# EAGLE design avrcam (EAGLE 4.13)

## Sheet 1 of 2
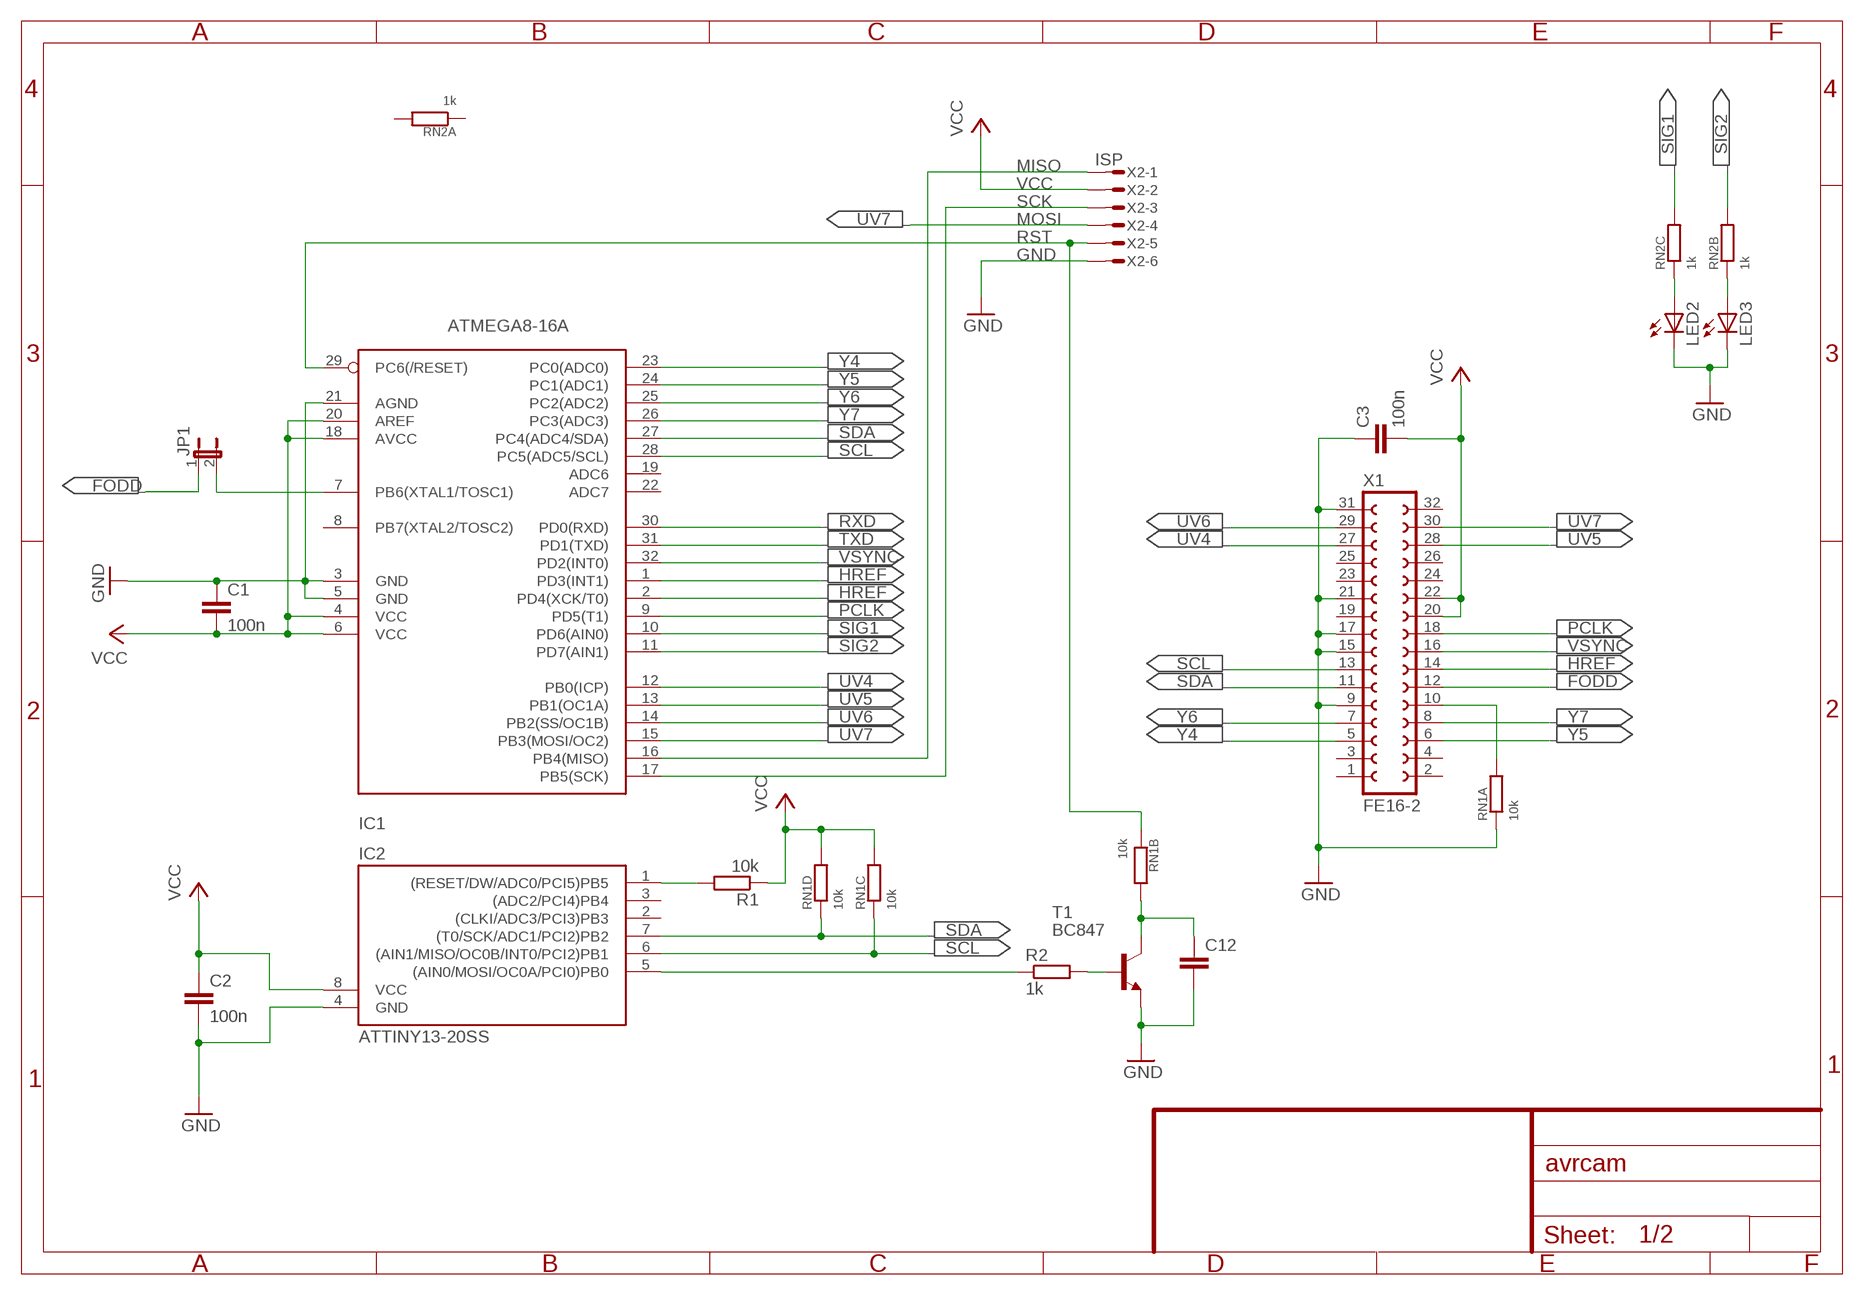
[diagram p0: schematic, sheet 1]

### Parts
C1  100n  C-EUC0603K  [C0603K]
C2  100n  C-EUC0603K  [C0603K]
C3  100n  C-EUC0603K  [C0603K]
C12  C-EUC0603K  [C0603K]
IC1  ATMEGA8-16A  [TQFP32-08]
IC2  ATTINY13-20SS  [SO08]
JP1  JP1E  [JP1]
LED2  LEDCHIPLED_1206  [CHIPLED_1206]
LED3  LEDCHIPLED_1206  [CHIPLED_1206]
R1  10k  R-EU_R0805  [R0805]
R2  1k  R-EU_R0805  [R0805]
RN1  10k  SMDNET4SINGLE  [SMDNET4]
RN2  1k  SMDNET4SINGLE  [SMDNET4]
T1  BC847  [SOT23]
X1  FE16-2  [FE16-2]
X2  ISP  MICROMATCH-6  [MICROMATCH-6]

### Nets
FODD: JP1.1 X1.12
GND: C1.1 C2.2 C3.1 C12.2 IC1.3(GND) IC1.5(GND) IC1.21(AGND) IC2.4(GND) LED2.C LED3.C RN1.1 T1.2(E) X1.9 X1.15 X1.17 X1.21 X1.31 X2.6 ; also sheet 2
HREF: IC1.1(PD3(INT1)) IC1.2(PD4(XCK/T0)) X1.14
MISO: IC1.16(PB4(MISO)) X2.1
N$1: IC2.1((RESET/DW/ADC0/PCI5)PB5) R1.2
N$2: IC1.7(PB6(XTAL1/TOSC1)) JP1.2
N$6: IC2.5((AIN0/MOSI/OC0A/PCI0)PB0) R2.1
N$9: R2.2 T1.1(B)
N$14: C12.1 RN1.7 T1.3(C)
N$15: LED3.A RN2.2
N$16: LED2.A RN2.3
N$18: RN1.8 X1.10
PCLK: IC1.9(PD5(T1)) X1.18
RST: IC1.29(PC6(/RESET)) RN1.2 X2.5
RXD: IC1.30(PD0(RXD)) ; also sheet 2
SCK: IC1.17(PB5(SCK)) X2.3
SCL: IC1.28(PC5(ADC5/SCL)) IC2.6((AIN1/MISO/OC0B/INT0/PCI2)PB1) RN1.3 X1.13
SDA: IC1.27(PC4(ADC4/SDA)) IC2.7((T0/SCK/ADC1/PCI2)PB2) RN1.4 X1.11
SIG1: IC1.10(PD6(AIN0)) RN2.6
SIG2: IC1.11(PD7(AIN1)) RN2.7
TXD: IC1.31(PD1(TXD)) ; also sheet 2
UV4: IC1.12(PB0(ICP)) X1.27
UV5: IC1.13(PB1(OC1A)) X1.28
UV6: IC1.14(PB2(SS/OC1B)) X1.29
UV7: IC1.15(PB3(MOSI/OC2)) X1.30 X2.4
VCC: C1.2 C2.1 C3.2 IC1.4(VCC) IC1.6(VCC) IC1.18(AVCC) IC1.20(AREF) IC2.8(VCC) R1.1 RN1.5 RN1.6 X1.20 X1.22 X2.2 ; also sheet 2
VSYNC: IC1.32(PD2(INT0)) X1.16
Y4: IC1.23(PC0(ADC0)) X1.5
Y5: IC1.24(PC1(ADC1)) X1.6
Y6: IC1.25(PC2(ADC2)) X1.7
Y7: IC1.26(PC3(ADC3)) X1.8
Unconnected: IC1.8(PB7(XTAL2/TOSC2)) IC1.19(ADC6) IC1.22(ADC7) IC2.2((CLKI/ADC3/PCI3)PB3) IC2.3((ADC2/PCI4)PB4) X1.1 X1.2 X1.3 X1.4 X1.19 X1.23 X1.24 X1.25 X1.26 X1.32

### Notes on the sheet
- MOSI

## Sheet 2 of 2
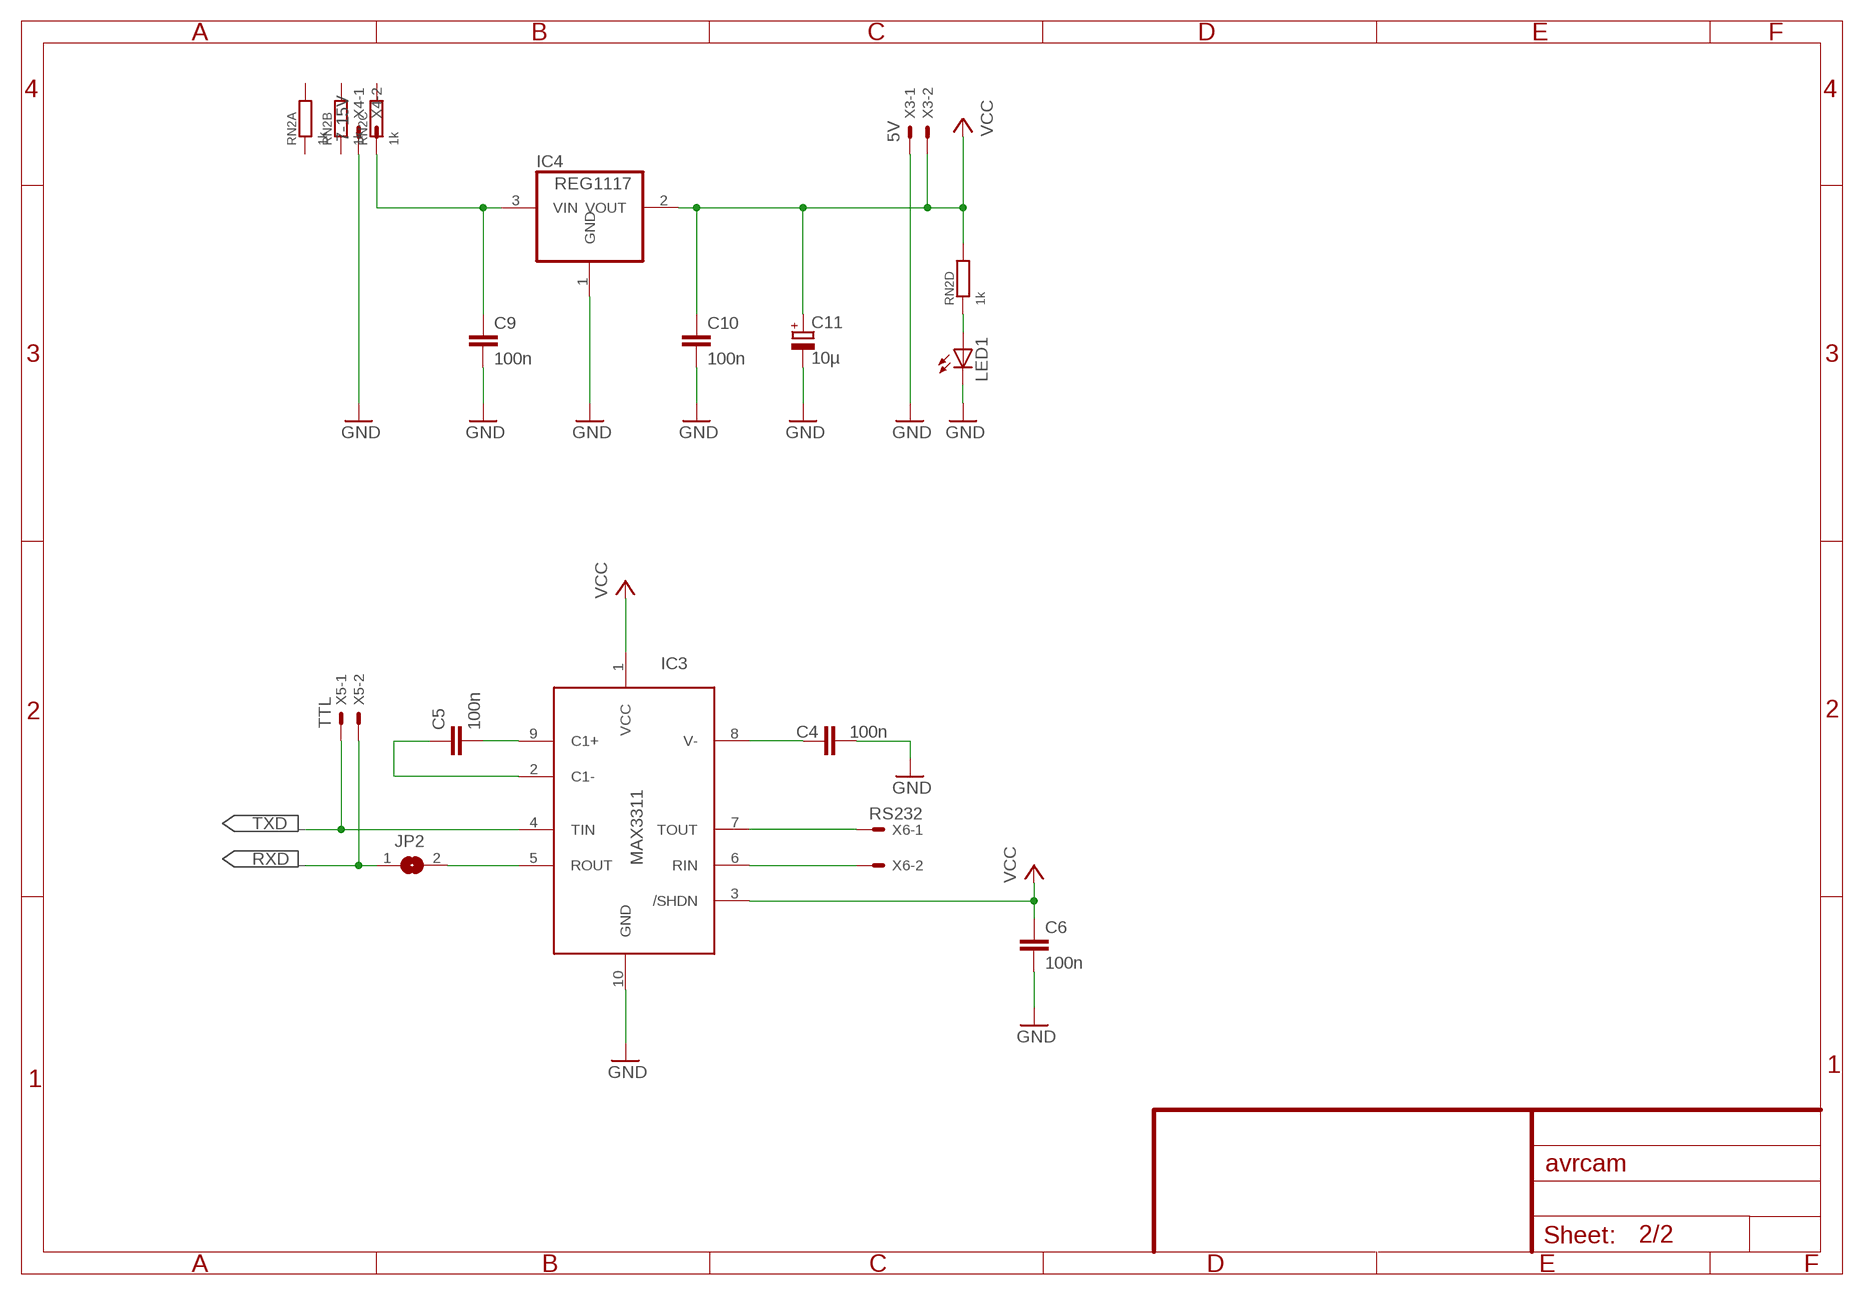
[diagram p1: schematic, sheet 2]

### Parts
C4  100n  C-EUC0603K  [C0603K]
C5  100n  C-EUC0603K  [C0603K]
C6  100n  C-EUC0603K  [C0603K]
C9  100n  C-EUC0603K  [C0603K]
C10  100n  C-EUC0603K  [C0603K]
C11  10µ  CPOL-EUCT3216  [CT3216]
IC3  MAX3311  [UMAX10]
IC4  REG1117  [SOT223]
JP2  SJ  [SJ]
LED1  LEDCHIPLED_1206  [CHIPLED_1206]
X3  5V  22-23-2021  [22-23-2021]
X4  7-15V  22-23-2021  [22-23-2021]
X5  TTL  22-23-2021  [22-23-2021]
X6  RS232  22-23-2021  [22-23-2021]

### Nets
GND: C4.2 C6.2 C9.2 C10.2 C11.- IC3.10(GND) IC4.1(GND) LED1.C X3.1 X4.1 ; also sheet 1
N$3: C5.2 IC3.9(C1+)
N$4: C5.1 IC3.2(C1-)
N$5: C4.1 IC3.8(V-)
N$7: IC3.5(ROUT) JP2.2
N$8: C9.1 IC4.3(VIN) X4.2
N$10: IC3.6(RIN) X6.2
N$11: IC3.7(TOUT) X6.1
N$12: LED1.A RN2.4
RXD: JP2.1 X5.2 ; also sheet 1
TXD: IC3.4(TIN) X5.1 ; also sheet 1
VCC: C6.1 C10.1 C11.+ IC3.1(VCC) IC3.3(/SHDN) IC4.2(VOUT) RN2.5 X3.2 ; also sheet 1
Unconnected: RN2.1 RN2.8

## Library data of the parts
C1-C6 C9 C10 C12 = rcl:C-EU: CAPACITOR, European symbol
C11 = rcl:CPOL-EU: POLARIZED CAPACITOR, European symbol
IC1 = avr:ATMEGA8: MICROCONTROLLER 8 Kbytes FLASH 1 kbytes SRAM 512 bytes EEPROM USART 6-channel 10 bit ADC 2-channel 8 bit ADC
IC2 = avr:ATTINY13: MICROCONTROLLER 1 Kbytes FLASH 64 bytes EEPROM 64 bytes RAM 4-channel 10 bit ADC
IC3 = maxim_updated:MAX3311
IC4 = burr-brown:REG1117: 800mA and 1A Low Dropout (LDO) Positive Regulator 1.8V, 2.5V, 2.85V, 3.3V, 5V, and Adj
JP1 = jumper:JP1E: JUMPER
JP2 = jumper:SJ: SMD solder JUMPER
LED1-LED3 = led:LED: LED OSRAM: - CHIPLED LG R971, LG N971, LY N971, LG Q971, LY Q971, LO R971, LY R971 LH N974, LH R974 LS Q976, LO Q976, LY Q976 LO Q996 - Hyper CHIPLED LW Q18S LB Q993, LB Q99A, LB R99A - SideLED LS A670, LO A670, LY A670, LG A670, LP A670 LB A673, LV A673, LT A673, LW A673 LH A674 LY A675 LS A676, LA A676, LO A676, LY A676, LW A676 LS A679, LY A679, LG A679 - Hyper Micro SIDELED® LS Y876, LA Y876, LO Y876, LY Y876 LT Y87S - SmartLED LW L88C, LW L88S LB L89C, LB L89S, LG L890 LS L89K, LO L89K, LY L89K LS L896, LA L896, LO L896, LY L896 - TOPLED LS T670, LO T670, LY T670, LG T670, LP T670 LSG T670, LSP T670, LSY T670, LOP T670, LYG T670 LG T671, LOG T671, LSG T671 LB T673, LV T673, LT T673, LW T673 LH T674 LS T676, LA T676, LO T676, LY T676, LB T676, LH T676, LSB T676, LW T676 LB T67C, LV T67C, LT T67C, LS T67K, LO T67K, LY T67K, LW E67C LS E67B, LA E67B, LO E67B, LY E67B, LB E67C, LV E67C, LT E67C LW T67C LS T679, LY T679, LG T679 LS T770, LO T770, LY T770, LG T770, LP T770 LB T773, LV T773, LT T773, LW T773 LH T774 LS E675, LA E675, LY E675, LS T675 LS T776, LA T776, LO T776, LY T776, LB T776 LHGB T686 LT T68C, LB T68C - Hyper Mini TOPLED® LB M676 - Mini TOPLED Santana® LG M470 LS M47K, LO M47K, LY M47K Source: http://www.osram.convergy.de/
R1 R2 = rcl:R-EU_: RESISTOR, European symbol
RN1 RN2 = ResNetSMD:SMDNET4SINGLE
T1 = transistor:BC847: NPN TRANSISTOR
X1 = con-lsta:FE16-2
X2 = con-amp-micromatch:MICROMATCH-6: MicroMaTch 6 7-215464-6 / 0-215464-6 Drawing Number C-215464 DDEController.pdf
X3-X6 = con-molex:22-23-2021: .100" (2.54mm) Center Header - 2 Pin

## Board
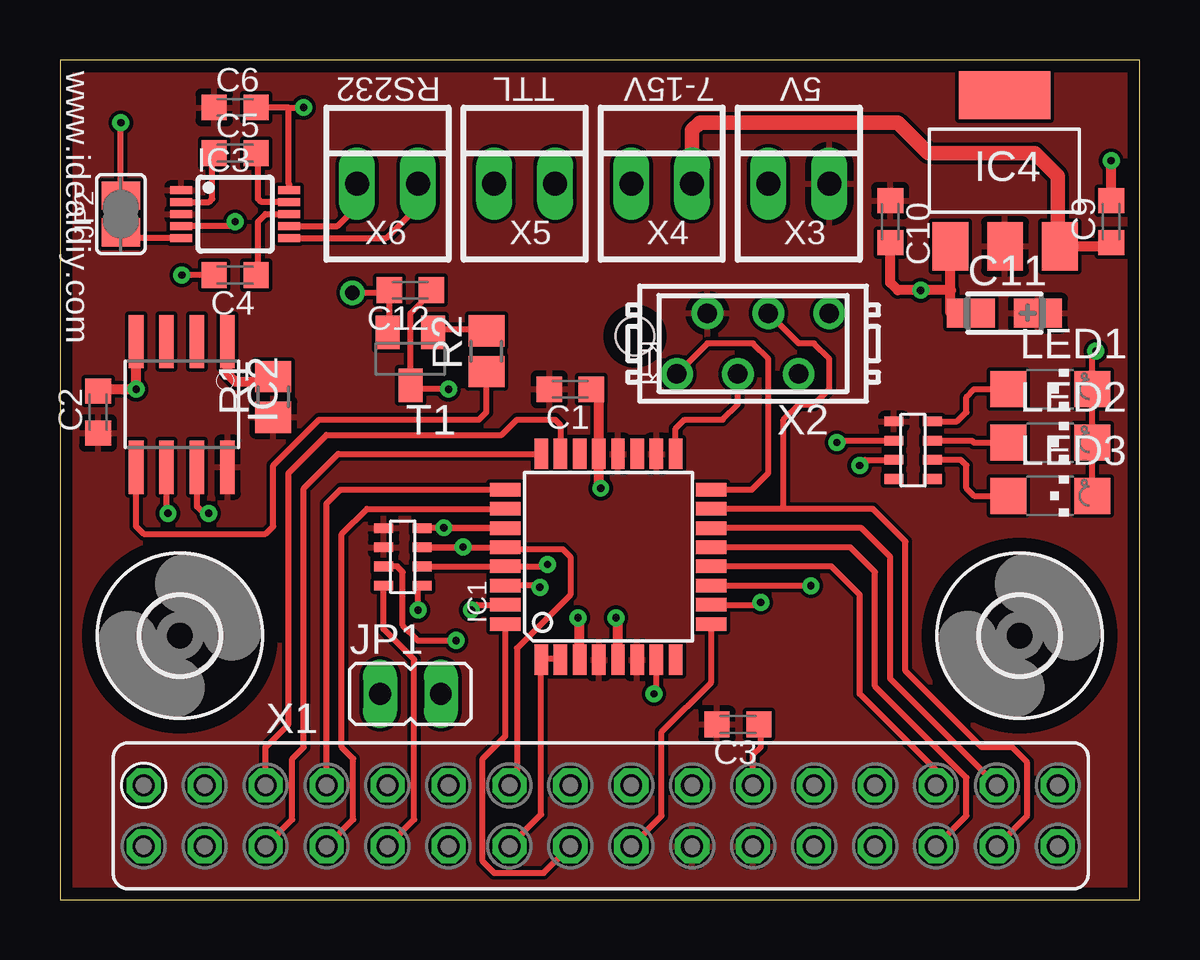
[diagram p2: board, top side]
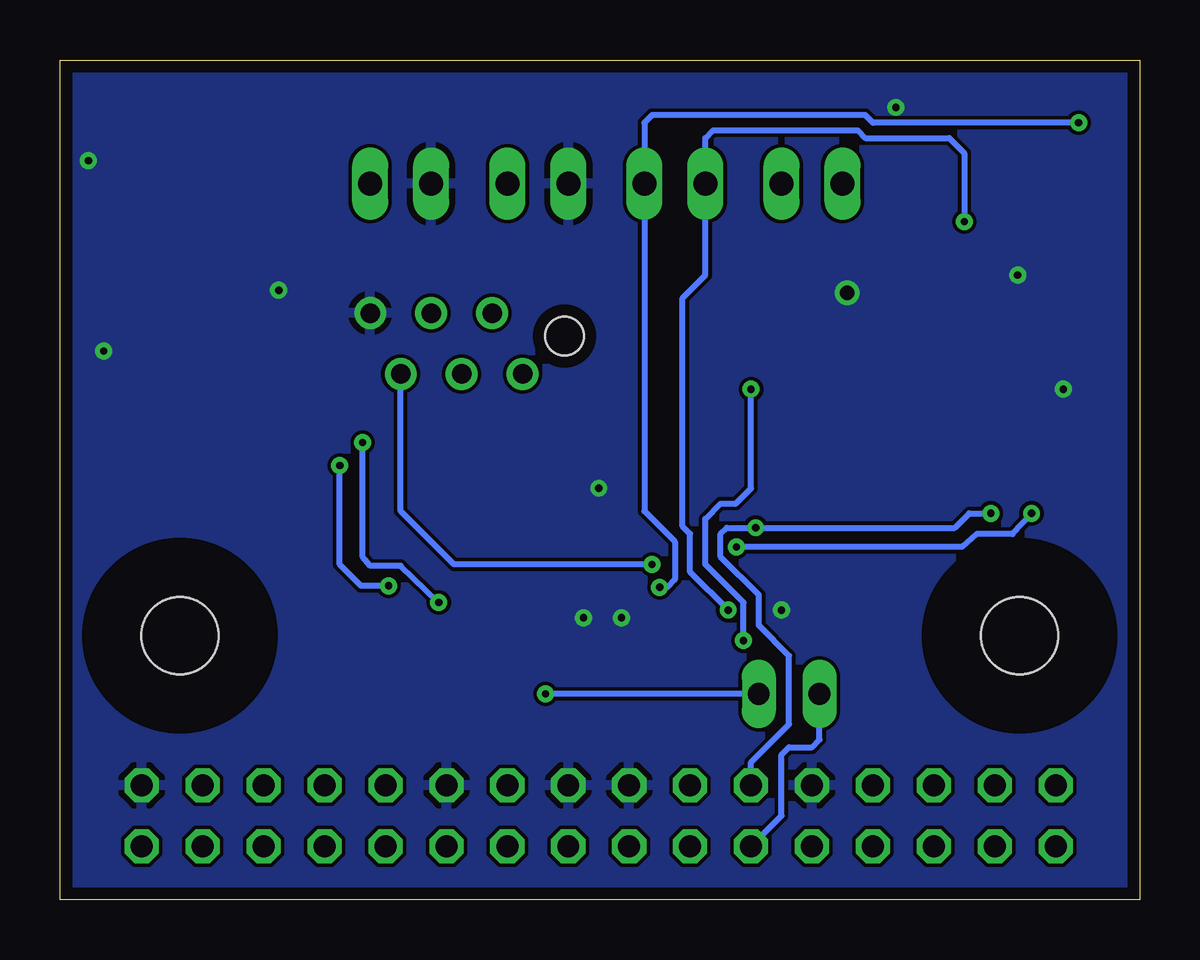
[diagram p3: board, bottom side, seen from below]

Size 45 x 35 mm. Coordinates in mm from the lower left corner, seen from the top.
Outline: 0,0 45,0 45,35 0,35 0,0
Copper layers (1*16): Top 0.035mm / dielectric 1.5mm / Bottom 0.035mm
Design rules "default": minimum track width 10mil, minimum drill 24mil, track to track 6mil, track to pad 6mil, pad to pad 6mil, via to via 6mil, smd to smd 6mil, copper to edge 20mil, drill to drill 5mil, minimum pad ring 10mil, minimum via ring 8mil, stop-mask expansion 4mil, vias tented up to drill 0mil, thermal gap 10mil
Holes 1.6 mm at 23.97,23.5

### Footprints (pad centres in the part's own frame; a part is rotated, then mirrored left to right if it is on the bottom)
C0603K = smd 1.05 x 1.08: 1 -0.875,0; 2 0.875,0
CT3216 = smd 2 x 1.2: + 1.4,0; - -1.4,0
TQFP32-08 = smd 1.27 x 0.559: 1 -4.293,2.8; 2 -4.293,2; 3 -4.293,1.2; 4 -4.293,0.4; 5 -4.293,-0.4; 6 -4.293,-1.2; 7 -4.293,-2; 8 -4.293,-2.8; 17 4.293,-2.8; 18 4.293,-2; 19 4.293,-1.2; 20 4.293,-0.4; 21 4.293,0.4; 22 4.293,1.2; 23 4.293,2; 24 4.293,2.8 | smd 0.559 x 1.27: 9 -2.8,-4.293; 10 -2,-4.293; 11 -1.2,-4.293; 12 -0.4,-4.293; 13 0.4,-4.293; 14 1.2,-4.293; 15 2,-4.293; 16 2.8,-4.293; 25 2.8,4.293; 26 2,4.293; 27 1.2,4.293; 28 0.4,4.293; 29 -0.4,4.293; 30 -1.2,4.293; 31 -2,4.293; 32 -2.8,4.293
SO08 = smd 0.61 x 2.21: 1 -1.905,-2.616; 2 -0.635,-2.616; 3 0.635,-2.616; 4 1.905,-2.616; 5 1.905,2.616; 6 0.635,2.616; 7 -0.635,2.616; 8 -1.905,2.616
UMAX10 = smd 0.32 x 0.9: 1 -1,-2.25; 2 -0.5,-2.25; 3 0,-2.25; 4 0.5,-2.25; 5 1,-2.25; 6 1,2.25; 7 0.5,2.25; 8 0,2.25; 9 -0.5,2.25; 10 -1,2.25
SOT223 = smd 1.499 x 2.007: 1 -2.261,-3.15; 2 0.025,-3.15; 3 2.311,-3.15 | smd 3.81 x 2.007: 4 0,3.15
JP1 = drill 0.914 long: 1 0,-1.27; 2 0,1.27
SJ = smd 1.168 x 1.6: 1 -0.762,0; 2 0.762,0
CHIPLED_1206 = smd 1.5 x 1.5: A 0,-1.75; C 0,1.75
R0805 = smd 1.3 x 1.5: 1 -0.85,0; 2 0.85,0
SMDNET4 = smd 0.8 x 0.4: 1 -0.8,1.2; 2 -0.8,0.4; 3 -0.8,-0.4; 4 -0.8,-1.2; 5 0.8,-1.2; 6 0.8,-0.4; 7 0.8,0.4; 8 0.8,1.2
SOT23 = smd 1 x 1.4: 1 -0.95,-1.1; 2 0.95,-1.1; 3 0,1.1
3,2 = hole 3.2: 0,0
FE16-2 = drill 0.914 octagon: 1 -19.05,1.27; 2 -19.05,-1.27; 3 -16.51,1.27; 4 -16.51,-1.27; 5 -13.97,1.27; 6 -13.97,-1.27; 7 -11.43,1.27; 8 -11.43,-1.27; 9 -8.89,1.27; 10 -8.89,-1.27; 11 -6.35,1.27; 12 -6.35,-1.27; 13 -3.81,1.27; 14 -3.81,-1.27; 15 -1.27,1.27; 16 -1.27,-1.27; 17 1.27,1.27; 18 1.27,-1.27; 19 3.81,1.27; 20 3.81,-1.27; 21 6.35,1.27; 22 6.35,-1.27; 23 8.89,1.27; 24 8.89,-1.27; 25 11.43,1.27; 26 11.43,-1.27; 27 13.97,1.27; 28 13.97,-1.27; 29 16.51,1.27; 30 16.51,-1.27; 31 19.05,1.27; 32 19.05,-1.27
MICROMATCH-6 = drill 0.813 round: 1 3.175,1.27; 2 1.905,-1.27; 3 0.635,1.27; 4 -0.635,-1.27; 5 -1.905,1.27; 6 -3.175,-1.27
22-23-2021 = drill 1 long: 1 -1.27,0; 2 1.27,0

### Placement (x,y rotation side)
C1  21.27,21.27 180 top
C2  1.59,20.32 90 top
C3  28.26,7.3 180 top
C4  7.3,26.04 180 top
C5  7.3,31.11 0 top
C6  7.3,33.02 0 top
C9  43.81,28.26 90 top
C10  34.61,28.26 270 top
C11  39.37,24.45 0 top
C12  14.61,25.4 180 top
IC1  22.86,14.29 90 top
IC2  5.08,20.64 180 top
IC3  7.3,28.57 270 top
IC4  39.37,30.38 0 top
JP1  14.61,8.57 270 top
JP2  2.54,28.57 270 top
LED1  41.27,21.27 270 top
LED2  41.27,19.05 270 top
LED3  41.27,16.83 270 top
R1  8.89,20.95 90 top
R2  17.78,22.86 90 top
RN1  14.29,14.29 180 top
RN2  35.56,18.73 180 top
T1  14.61,22.54 180 top
U$1  [3,2]  5,11 0 top
U$2  [3,2]  40,11 0 top
X1  22.54,3.49 0 top
X2  28.89,23.18 180 top
X3  30.8,29.84 0 top
X4  25.08,29.84 0 top
X5  19.37,29.84 0 top
X6  13.65,29.84 0 top

### Tracks (layer width: path | path; a pad name or v marks a point on that pad's centre or on a via)
FODD
  Bottom 0.254: JP1.1 13.34,6.67 13.65,6.35 14.61,6.35 14.92,6.03 14.92,3.49 X1.12
GND  (via drill 0.3, 0.61)
  Top 0.254: 9.53,33.02 C6.2 | IC3.10 9.55,29.82 9.53,29.84 9.53,33.02 | 9.53,33.02 v10.16,33.02 | C4.2 v5.08,26.04 | LED3.C 43.02,18.89 43.18,19.05 LED2.C 43.02,21.12 43.18,21.27 LED1.C 43.02,22.7 v43.18,22.86 | T1.2 13.72,24.08 13.72,24.99 C12.2 13.41,25.3 v12.19,25.3 | 15.24,13.11 RN1.1 14.85,13.09 14.92,13.02 v14.92,12.06 | X1.21 28.89,6.03 29.21,6.35 29.21,6.99 29.13,7.06 C3.1
  Top 0.406: IC1.3 21.66,11.68 arc90 v21.59,11.75 | IC1.5 23.26,11.66 arc90 v23.18,11.75 | v22.54,17.14 arc-90 22.46,17.23 IC1.21 22.46,20.87 22.23,21.27 C1.1 | IC2.4 v3.17,21.27 1.59,21.27 C2.2 | C10.2 34.61,25.72 34.92,25.4 v35.88,25.4 37.11,25.4 | 37.11,25.4 37.11,24.49 37.15,24.45 C11.- | 37.11,25.4 IC4.1 | 37.11,25.4 37.15,25.4 | C9.2 v43.81,30.8
  pour Bottom: 0,35.01 45.09,35.01 45.09,0 0,0
HREF
  Top 0.254: IC1.2 20.73,10.06 20.12,10.06 IC1.1 20.06,3.55 X1.14
MISO
  Top 0.254: X2.1 26.99,23.18 28.89,23.18 29.53,22.54 29.53,17.78 28.84,17.09 IC1.16
N$1
  Top 0.406: IC2.1 6.99,21.91 7.3,21.59 8.57,21.59 8.79,21.8 R1.2
N$2  (via drill 0.3)
  Top 0.254: IC1.7 24.86,8.67 v24.77,8.57
  Bottom 0.254: JP1.2 v24.77,8.57
N$3
  Top 0.254: IC3.9 8.39,29.07 8.26,29.21 8.26,31.11 C5.2
N$4
  Top 0.254: IC3.2 6.21,29.07 6.35,29.21 6.35,31.11 C5.1
N$5
  Top 0.254: IC3.8 8.57,28.57 8.26,28.26 8.26,26.04 C4.1
N$6
  Top 0.254: R2.1 17.78,20.32 17.46,20 10.79,20 8.89,18.1 8.89,15.56 8.57,15.24 3.49,15.24 3.17,15.56 IC2.5
N$7
  Top 0.254: JP2.2 2.54,27.62 2.59,27.57 IC3.5
N$8
  Top 0.406: C9.1 43.81,27.3 43.79,27.33 43.8,27.3 43.8,27.23 IC4.3
  Top 0.61: X4.2 26.35,32.07 26.67,32.38 34.92,32.38 36.2,31.11 40.64,31.11 41.59,30.16 41.59,27.62 41.68,27.53 IC4.3
N$9
  Top 0.254: T1.1 15.85,23.77 17.07,23.77 R2.2
N$10
  Top 0.254: IC3.6 13.61,27.57 14.92,28.89 X6.2
N$11
  Top 0.254: IC3.7 11.56,28.07 12.38,28.89 X6.1
N$12
  Top 0.254: RN2.4 37.4,19.93 37.78,20.32 37.78,20.95 38.1,21.27 LED1.A
N$14  (via drill 0.3)
  Top 0.254: C12.1 15.56,25.4 14.61,24.45 T1.3 14.61,21.27 v16.19,21.27 | RN1.7 14.05,13.89 14.29,13.65 14.29,11.43 14.92,10.79 v16.51,10.79
  Bottom 0.254: v16.51,10.79 16.51,12.38 18.1,13.97 18.1,15.88 17.46,16.51 16.83,16.51 16.19,17.14 v16.19,21.27
N$15
  Top 0.254: RN2.2 37.55,18.33 37.78,18.1 37.78,17.14 38.1,16.83 LED3.A
N$16
  Top 0.254: RN2.3 38.02,19.13 38.1,19.05 LED2.A
N$18
  Top 0.254: RN1.8 13.49,11.28 14.76,10 14.76,3.33 X1.10
PCLK
  Top 0.254: IC1.9 27.15,9.05 25.08,6.99 25.08,3.49 X1.18
RST  (via drill 0.3)
  Top 0.254: RN1.2 18.33,13.89 18.41,13.97 18.5,13.89 IC1.29 20.24,13.89 v20.32,13.97
  Bottom 0.254: v20.32,13.97 28.57,13.97 30.8,16.19 X2.5
RXD  (via drill 0.3)
  Top 0.254: JP2.1 v2.54,32.38 | IC1.30 19.93,13.09 v20,13.02
  Bottom 0.254: v2.54,32.38 11.11,32.38 11.43,32.7 20.32,32.7 20.64,32.38 X5.2 20.64,16.19 19.37,14.92 19.37,13.34 19.68,13.02 v20,13.02
SCK
  Top 0.254: IC1.17 25.66,19.63 26.04,20 27.62,20 28.26,20.64 X2.3
SCL  (via drill 0.3)
  Top 0.254: 18.41,14.61 18.5,14.69 IC1.28 | 18.41,14.61 18.33,14.69 RN1.3 16.79,14.69 v16.8,14.7 | IC2.6 4.45,16.25 v4.5,16.1 | 18.41,14.61 20.95,14.61 21.27,14.29 21.27,12.7 19.05,10.48 19.05,5.08 X1.13
  Bottom 0.254: v16.8,14.7 7.4,14.7 6.8,15.24 5.3,15.24 v4.5,16.1
SDA  (via drill 0.3)
  Top 0.254: 18.48,15.49 18.41,15.56 18.34,15.49 | 18.48,15.49 IC1.27 18.57,15.4 | IC2.7 5.71,16.39 6,16.1 v6.2,16.1 | 18.57,15.4 | 18.34,15.49 RN1.4 | 18.34,15.49 18.48,15.49 | 18.48,15.49 18.57,15.4 | 18.34,15.49 16,15.49 v16,15.5
  Bottom 0.254: v6.2,16.1 7.1,16.1 7.7,15.5 15.9,15.5 v16,15.5 17.2,15.5 17.46,15.24 17.46,14.29 15.88,12.7 15.88,11.43 14.61,10.16 14.61,7.3 16.19,5.71 X1.11
SIG1  (via drill 0.3)
  Top 0.254: RN2.6 32.47,19.13 v32.38,19.05 | IC1.10 29.11,12.29 v29.21,12.38
  Bottom 0.254: v32.38,19.05 32.38,14.29 32.07,13.91 30.8,13.91 v29.21,12.38
SIG2  (via drill 0.3)
  Top 0.254: RN2.7 33.57,18.33 v33.34,18.1 | IC1.11 31.3,13.09 v31.3,13.08
  Bottom 0.254: v33.34,18.1 33.34,13.97 32.45,13.08 v31.3,13.08
TXD  (via drill 0.3)
  Top 0.254: IC3.4 7.12,28.07 v7.3,28.26 | IC1.31 17.37,12.29 v17.14,12.06
  Bottom 0.254: v7.3,28.26 7.3,31.11 7.94,31.75 11.43,31.75 11.75,32.07 17.78,32.07 18.1,31.75 X5.1 18.1,26.04 19.05,25.08 19.05,15.56 18.73,15.24 18.73,13.65 v17.14,12.06
UV4
  Top 0.254: X1.27 36.51,5.4 33.34,8.57 33.34,12.7 32.15,13.89 IC1.12
UV5
  Top 0.254: X1.28 37.78,3.49 37.78,5.08 33.97,8.89 33.97,13.65 32.94,14.69 IC1.13
UV6
  Top 0.254: X1.29 34.61,9.21 34.61,14.29 33.41,15.49 IC1.14
UV7
  Top 0.254: X1.30 40.32,3.49 40.32,5.71 39.69,6.35 38.42,6.35 35.24,9.53 35.24,14.92 33.88,16.29 30.16,16.29 | 30.16,16.29 IC1.15 | X2.4 30.8,23.18 31.43,23.18 32.07,22.54 32.07,21.27 31.43,20.64 30.8,20.64 30.16,20 30.16,16.29
VCC
  pour Top: 0,35.01 45.09,35.01 45.09,0 0,0
VSYNC
  Top 0.254: IC1.32 18.57,6.82 17.62,5.87 17.62,1.59 18.1,1.11 20.16,1.11 X1.16
Y4
  Top 0.254: IC1.23 20.86,19.78 20.64,20 19.05,20 18.41,19.37 11.11,19.37 9.53,17.78 9.53,7.3 8.57,6.35 X1.5
Y5
  Top 0.254: IC1.24 11.6,18.58 10.16,17.14 10.16,6.35 9.68,5.87 9.68,3.33 X1.6
Y6
  Top 0.254: IC1.25 11.69,17.09 11.11,16.51 X1.7
Y7
  Top 0.254: IC1.26 12.79,16.29 11.75,15.24 11.75,6.35 12.22,5.87 12.22,3.33 X1.8

### Text on the board
tPlace: www.idealdiy.com | RS232 | TTL | 7-15V | 5V